# EAGLE design untitled (EAGLE 9.1.3)

## Sheet 1 of 2
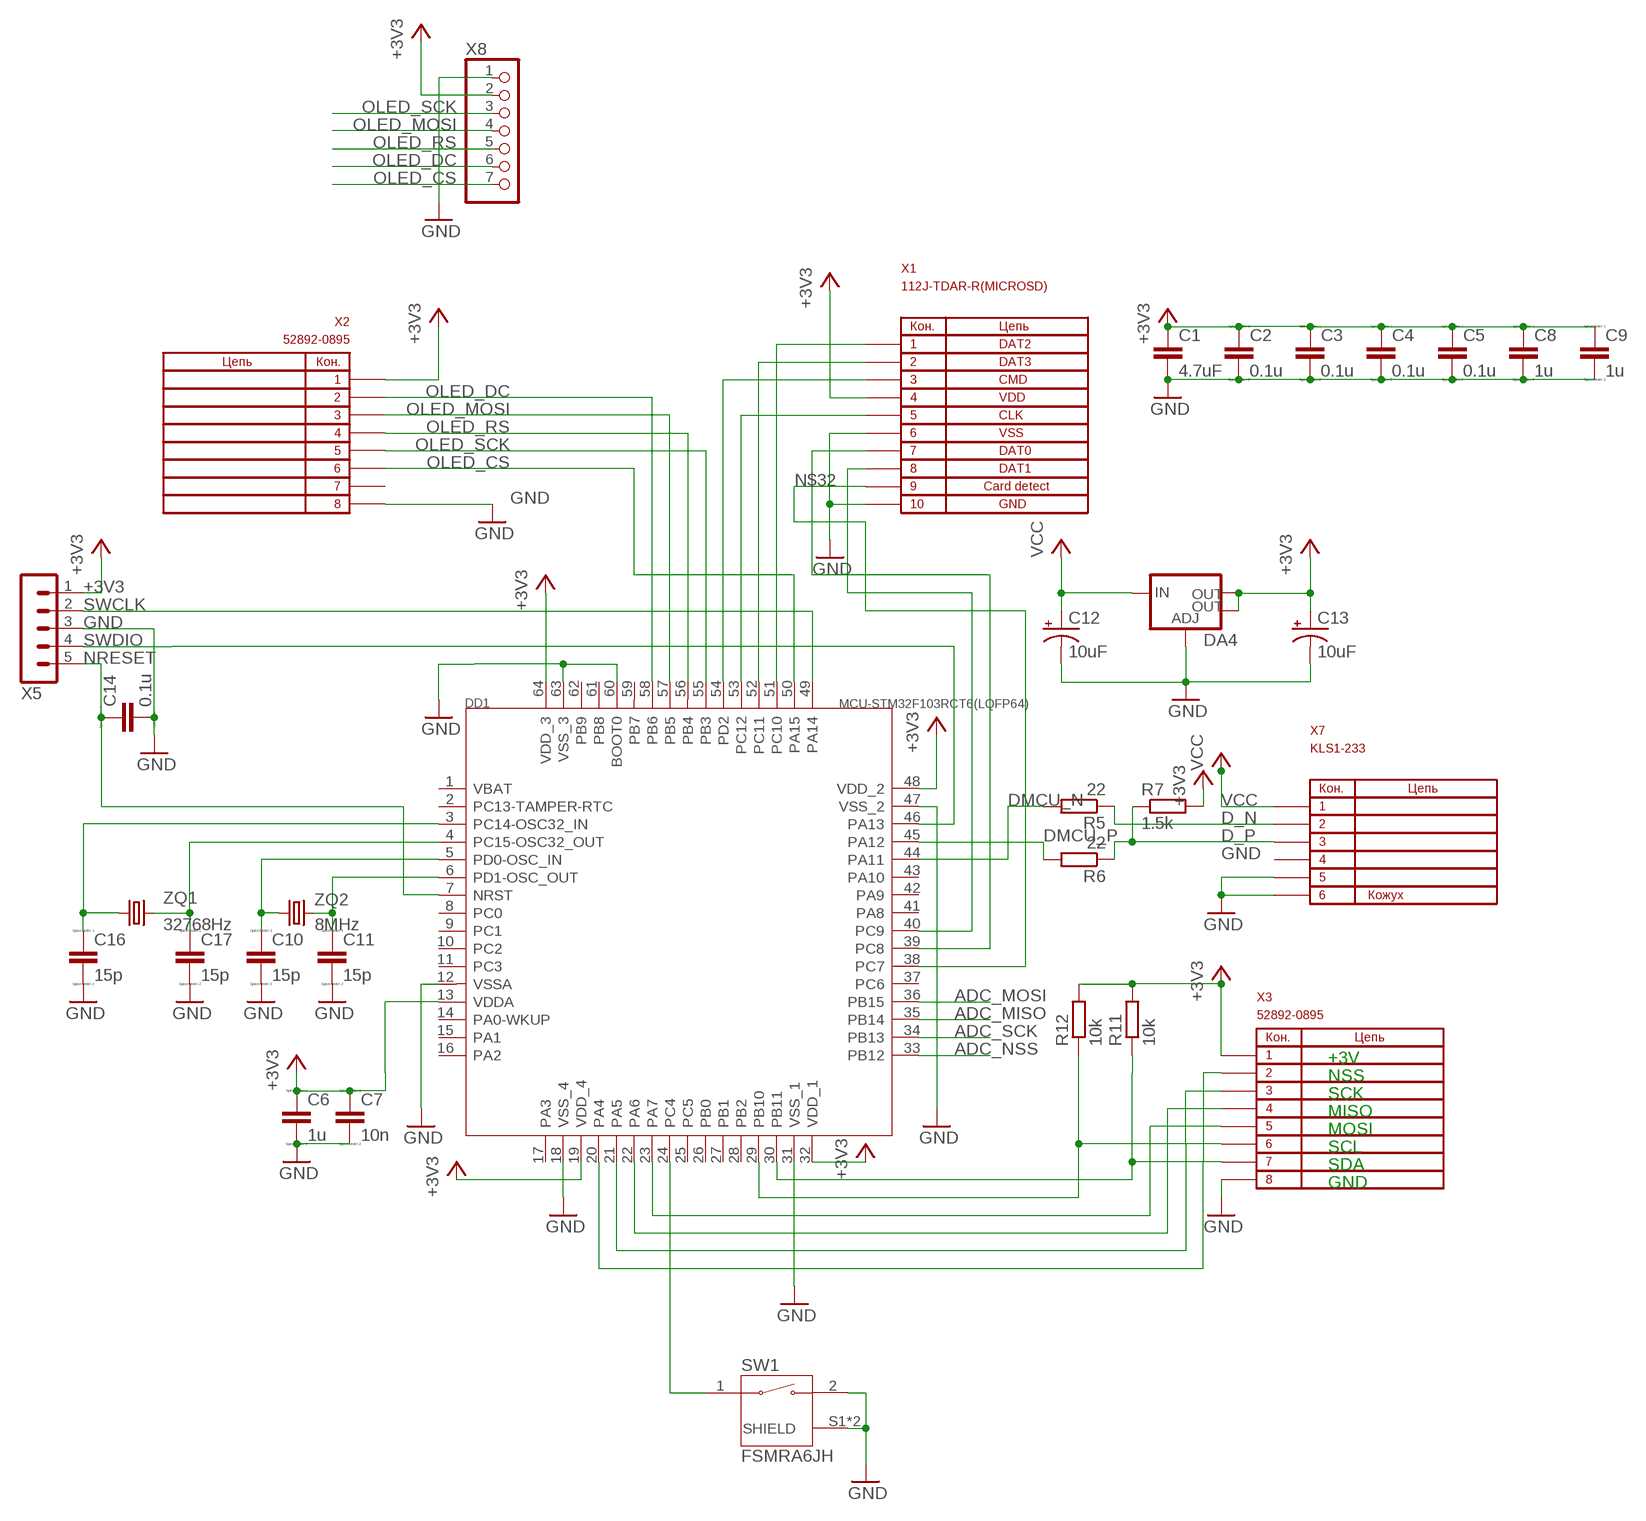
[diagram p0: schematic, sheet 1]

### Parts
C1  4.7uF  4.7UF0603  [0603]
C2  0.1u  CC0603  [C0603]
C3  0.1u  CC0603  [C0603]
C4  0.1u  CC0603  [C0603]
C5  0.1u  CC0603  [C0603]
C6  1u  CC0603  [C0603]
C7  10n  CC0603  [C0603]
C8  1u  CC0603  [C0603]
C9  1u  CC0603  [C0603]
C10  15p  CC0603  [C0603]
C11  15p  CC0603  [C0603]
C12  10uF  10UF-POLAR-EIA3216-16V-10%(TANT)  [EIA3216]
C13  10uF  10UF-POLAR-EIA3216-16V-10%(TANT)  [EIA3216]
C14  0.1u  CC0603  [C0603]
C16  15p  CC0603  [C0603]
C17  15p  CC0603  [C0603]
DA4  V_REG_LM1117SOT223  [SOT223]
DD1  MCU-STM32F103RCT6(LQFP64)  [LQFP64-0.5-10X10MM]
R5  22  R-EU_R0603  [R0603]
R6  22  R-EU_R0603  [R0603]
R7  1.5k  R-EU_R0603  [R0603]
R11  10k  R-EU_R0603  [R0603]
R12  10k  R-EU_R0603  [R0603]
SW1  FSMRA6JH  [TE_FSMRA6JH]
X1  112J-TDAR-R(MICROSD)  [112J-TDAR-R]
X2  52892-0895  [MOLEX_52892-0895]
X3  52892-0895  [MOLEX_52892-0895]
X5  MA05-1  [MA05-1]
X7  KLS1-233  [KLS1-233]
X8  PINHD-1X7  [1X07]
ZQ1  32768Hz  KX-327-NHT  [3.2X1.5]
ZQ2  8MHz  CRYSTALHC49UP  [HC49UP]

### Nets
+3V3: C1.1 C2.1 C3.1 C4.1 C5.1 C6.1 C7.1 C8.1 C9.1 C13.+ DA4.2(OUT) DA4.4(OUT) DD1.13(VDDA) DD1.19(VDD_4) DD1.32(VDD_1) DD1.48(VDD_2) DD1.64(VDD_3) R7.2 R11.2 R12.2 X1.P$4 X2.1 X3.1 X5.1 X8.2 ; also sheet 2
ADC_MISO: DD1.35(PB14) ; also sheet 2
ADC_MOSI: DD1.36(PB15) ; also sheet 2
ADC_NSS: DD1.33(PB12) ; also sheet 2
ADC_SCK: DD1.34(PB13) ; also sheet 2
D_N [diff pair]: R5.1 X7.2
D_P [diff pair]: R6.1 R7.1 X7.3
DMCU_N [diff pair]: DD1.44(PA11) R5.2
DMCU_P [diff pair]: DD1.45(PA12) R6.2
GND: C1.2 C2.2 C3.2 C4.2 C5.2 C6.2 C7.2 C8.2 C9.2 C10.2 C11.2 C12.- C13.- C14.2 C16.2 C17.2 DA4.1(ADJ) DD1.12(VSSA) DD1.18(VSS_4) DD1.31(VSS_1) DD1.47(VSS_2) DD1.60(BOOT0) DD1.63(VSS_3) SW1.2 SW1.S1(SHIELD) SW1.S2(SHIELD) X1.P$6 X1.P$10 X1.P$11 X1.P$12 X1.P$13 X2.8 X3.8 X5.3 X7.5 X7.SH4 X7.SH5 X7.SH6 X7.SH7 X8.1 ; also sheet 2
N$1: C10.1 DD1.5(PD0-OSC_IN) ZQ2.1
N$2: C11.1 DD1.6(PD1-OSC_OUT) ZQ2.2
N$7: C17.1 DD1.4(PC15-OSC32_OUT) ZQ1.2
N$8: C16.1 DD1.3(PC14-OSC32_IN) ZQ1.1
N$13: DD1.54(PD2) X1.P$3
N$14: DD1.53(PC12) X1.P$5
N$15: DD1.52(PC11) X1.P$2
N$16: DD1.51(PC10) X1.P$1
N$17: DD1.24(PC4) SW1.1
N$18: DD1.40(PC9) X1.P$8
N$19: DD1.39(PC8) X1.P$7
N$24: DD1.30(PB11) R11.1 X3.7
N$27: DD1.29(PB10) R12.1 X3.6
N$28: DD1.23(PA7) X3.5
N$29: DD1.22(PA6) X3.4
N$30: DD1.21(PA5) X3.3
N$31: DD1.20(PA4) X3.2
N$32: DD1.38(PC7) X1.P$9
NRESET: C14.1 DD1.7(NRST) X5.5
OLED_CS: DD1.50(PA15) X2.6 X8.7
OLED_DC: DD1.58(PB6) X2.2 X8.6
OLED_MOSI: DD1.57(PB5) X2.3 X8.4
OLED_RS: DD1.56(PB4) X2.4 X8.5
OLED_SCK: DD1.55(PB3) X2.5 X8.3
SWCLK: DD1.49(PA14) X5.2
SWDIO: DD1.46(PA13) X5.4
VCC: C12.+ DA4.3(IN) X7.1
Unconnected: DD1.1(VBAT) DD1.2(PC13-TAMPER-RTC) DD1.8(PC0) DD1.9(PC1) DD1.10(PC2) DD1.11(PC3) DD1.14(PA0-WKUP) DD1.15(PA1) DD1.16(PA2) DD1.17(PA3) DD1.25(PC5) DD1.26(PB0) DD1.27(PB1) DD1.28(PB2) DD1.37(PC6) DD1.41(PA8) DD1.42(PA9) DD1.43(PA10) DD1.59(PB7) DD1.61(PB8) DD1.62(PB9) X2.7 X7.4

### Notes on the sheet
- +3V
- NSS
- SCK
- MISO
- MOSI
- SCL
- SDA
- GND

## Sheet 2 of 2
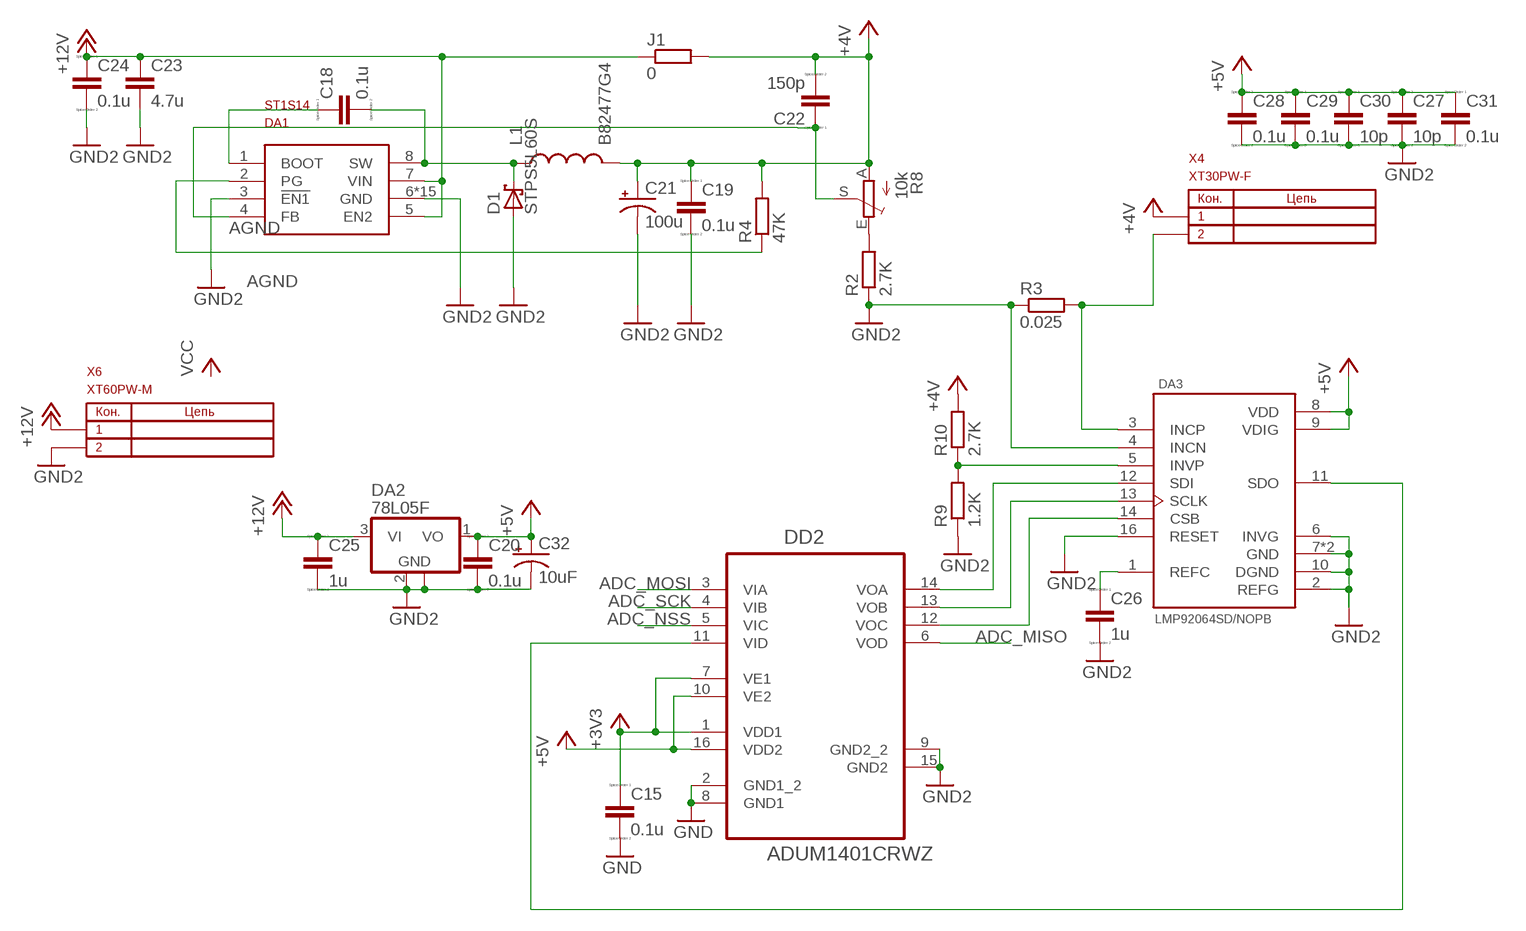
[diagram p1: schematic, sheet 2]

### Parts
C15  0.1u  CC0603  [C0603]
C18  0.1u  CC0603  [C0603]
C19  0.1u  CC0603  [C0603]
C20  0.1u  CC0603  [C0603]
C21  100u  CPOL-US150CLZ-1014  [150CLZ-1014]
C22  150p  CC0603  [C0603]
C23  4.7u  C-EUC2220K  [C2220K]
C24  0.1u  CC0603  [C0603]
C25  1u  CC1206  [C1206]
C26  1u  CC0603  [C0603]
C27  10p  CC0603  [C0603]
C28  0.1u  CC0603  [C0603]
C29  0.1u  CC0603  [C0603]
C30  10p  CC0603  [C0603]
C31  0.1u  CC0603  [C0603]
C32  10uF  10UF-POLAR-EIA3216-16V-10%(TANT)  [EIA3216]
D1  STPS5L60S  [SMC]
DA1  ST1S14  [HSOP8]
DA2  78L05F  [SOT89]
DA3  LMP92064SD/NOPB  [SON50P400X500X80-17N]
DD2  ADUM1401CRWZ  [SO-16W]
J1  0  R-EU_R2010  [R2010]
L1  B82477G4  [B82477G4]
R2  2.7K  R-EU_R0603  [R0603]
R3  0.025  R-EU_R2010  [R2010]
R4  47K  R-EU_R0603  [R0603]
R8  10k  TRIM_EU-CA6V  [CA6V]
R9  1.2K  R-EU_R0603  [R0603]
R10  2.7K  R-EU_R0603  [R0603]
X4  XT30PW-F  [XT30PW-F]
X6  XT60PW-M  [XT60PW-M]

### Nets
+3V3: C15.1 DD2.1(VDD1) DD2.7(VE1) ; also sheet 1
+4V: C19.1 C21.+ C22.2 J1.2 L1.P$2 R4.2 R8.A R10.2 X4.P$2
+5V: C20.1 C27.1 C28.1 C29.1 C30.1 C31.1 C32.+ DA2.1(VO) DA3.8(VDD) DA3.9(VDIG) DD2.10(VE2) DD2.16(VDD2)
+12V: C23.1 C24.1 C25.1 DA1.5(EN2) DA1.7(VIN) DA2.3(VI) J1.1 X6.P$2
ADC_MISO: DD2.6(VOD) ; also sheet 1
ADC_MOSI: DD2.3(VIA) ; also sheet 1
ADC_NSS: DD2.5(VIC) ; also sheet 1
ADC_SCK: DD2.4(VIB) ; also sheet 1
AGND: C19.2 C20.2 C21.- C23.2 C24.2 C25.2 C26.2 C27.2 C28.2 C29.2 C30.2 C31.2 C32.- D1.A DA1.3(!EN1) DA1.6(GND) DA1.P$9(GND) DA1.P$10(GND) DA1.P$11(GND) DA1.P$12(GND) DA1.P$13(GND) DA1.P$14(GND) DA1.P$15(GND) DA1.P$16(GND) DA1.P$17(GND) DA1.P$18(GND) DA1.P$19(GND) DA1.P$20(GND) DA1.P$21(GND) DA1.P$22(GND) DA2.2(GND) DA2.2@1(GND) DA3.2(REFG) DA3.4(INCN) DA3.6(INVG) DA3.7(GND) DA3.10(DGND) DA3.16(RESET) DA3.17(GND) DD2.9(GND2_2) DD2.15(GND2) R2.1 R3.1 R9.1 X6.P$1 ; supply symbol labelled GND2
GND: C15.2 DD2.2(GND1_2) DD2.8(GND1) ; also sheet 1
N$3: C26.1 DA3.1(REFC)
N$4: C18.1 DA1.1(BOOT)
N$5: DA3.13(SCLK) DD2.13(VOB)
N$6: DA3.14(CSB) DD2.12(VOC)
N$9: C18.2 D1.C DA1.8(SW) L1.P$1
N$10: C22.1 DA1.4(FB) R8.S
N$11: DA3.12(SDI) DD2.14(VOA)
N$12: DA1.2(PG) R4.1
N$22: R2.2 R8.E
N$23: DA3.3(INCP) R3.2 X4.P$1
N$25: DA3.5(INVP) R9.2 R10.1
N$26: DA3.11(SDO) DD2.11(VID)

## Library data of the parts
C1 = SparkFun-Capacitors:4.7UF: 4.7µF ceramic capacitors A capacitor is a passive two-terminal electrical component used to store electrical energy temporarily in an electric field.; PROD_ID: CAP-08280
C2-C11 C14-C20 C22 C24-C31 = eagle-ltspice:C: CAPACITOR, European symbol; SPICEMODEL: NONE; SPICEPREFIX: C
C12 C13 C32 = SparkFun-Capacitors:10UF-POLAR: 10.0µF polarized capacitors A capacitor is a passive two-terminal electrical component used to store electrical energy temporarily in an electric field.; PROD_ID: CAP-00811
C21 = rcl:CPOL-US: POLARIZED CAPACITOR, American symbol; SPICEPREFIX: C
C23 = rcl:C-EU: CAPACITOR, European symbol; SPICEPREFIX: C
D1 = untitled:STPS5L60S
DA1 = untitled:ST1S14
DA2 = linear:78L*: POSITOIV-VOLTAGE REGULATORS Output up to 100 mA Source: Datasheet <http://focus.ti.com/lit/ds/symlink/ua78l05.pdf>
DA3 = LMP92064SD_NOPB:LMP92064SD/NOPB: 125kSps Simultaneous Sampling, Low-Side, SPI Interface Current/Voltage Monitor 16-WSON -40 to 105; AVAILABILITY: Unavailable; DESCRIPTION: 125kSps Simultaneous Sampling, Low-Side, SPI Interface Current/Voltage Monitor 16-WSON -40 to 105; MF: Texas Instruments; MP: LMP92064SD/NOPB; PACKAGE: WSON-16 Texas Instruments; PRICE: None
DA4 = SparkFun-IC-Power:V_REG_LM1117: Voltage Regulator LM1117 Standard adjustable voltage regulator but in SMD form. Spark Fun Electronics SKU : COM-00595; PROD_ID: VREG-08170
DD1 = MCU-STM32F103RCT6_LQFP64_:MCU-STM32F103RCT6(LQFP64): 310010073; AVAILABILITY: Unavailable; DESCRIPTION: Mainstream Performance line, ARM Cortex-M3 MCU with 256 Kbytes Flash, 72 MHz CPU, motor control, USB and CAN; MF: STMicroelectronics; MP: STM32F103RCT6; PACKAGE: LQFP-64 STMicroelectronics; PRICE: None
DD2 = ADUM1401WTRWZ:ADUM1401CRWZ: IC, DIGITAL ISOLATOR; AVAILABILITY: Unavailable; DESCRIPTION: Ic Isolator Dig 4ch 125c 16soic - Adum1401wtrwz; MF: Analog Devices; MP: ADUM1401CRWZ; PACKAGE: SOIC-16 Analog Devices; PRICE: None
J1 R3 = rcl:R-EU_: RESISTOR, European symbol; SPICEPREFIX: R
L1 = untitled:B82477G4
R2 R4-R7 R9-R12 = resistor:R-EU_: RESISTOR, European symbol
R8 = pot:TRIM_EU-: POTENTIOMETER
SW1 = FSMRA6JH:FSMRA6JH: Switch, Tactile, Spno, r/a; AVAILABILITY: Unavailable; DESCRIPTION: Switch, Tactile, Spno, r/a; MF: TE Connectivity; MP: FSMRA6JH; PACKAGE: None; PRICE: None; TE_PURCHASE_URL: https://www.te.com/usa-en/product-FSMRA6JH.html?te_bu=Cor&te_type=disp&te_campaign=seda_glo_cor-seda-global-disp-prtnr-fy19-seda-model-bom-cta_sma-317_1&elqCampaignId=32493
X1 = untitled:112J-TDAR-R(MICROSD)
X2 X3 = 52892-0895:52892-0895: CONNECTOR, FPC, ZIF, 0.50MM, 08 WAY; AVAILABILITY: Unavailable; DESCRIPTION: Conn FFC/FPC Connector SKT 8 POS 0.5mm Solder RA SMD Embossed T/R; MF: Molex; MP: 52892-0895; PACKAGE: None; PRICE: None
X4 = untitled:XT30PW-F
X5 = con-lstb:MA05-1: PIN HEADER; OC_FARNELL: unknown; OC_NEWARK: unknown
X6 = untitled:XT60PW-M
X7 = untitled:KLS1-233
X8 = pinhead:PINHD-1X7: PIN HEADER
ZQ1 = crystal-geyer_V1_0:KX-327: Tuning Fork Crystals (kHz) SMD: KX327 - Serie Model Size l/w/h [mm] Frequency Range Frequency Stability Temp. Range [°C] Load Capacitance AECQ 200 availabel Datasheet KX-327VT KX-327FT KX-327RT KX-327NHT KX-327NHF KX-327L KX-327S 1.25/1.05/0.5 1.6/1.0/0.5 2.0/1.2/0.6 3.2/1.5/0.8 3.2/1.5/0.8 7.0/1.5/1.4 8.2/3.8/2.5 32,768 kHz 32,768 kHz 32,768 kHz 32,768 kHz 32,768 kHz 32,768 kHz 32,768 kHz ±10 … ±20ppm ±10 … ±20ppm ±10 … ±20ppm ±10 … ±20ppm ±10 … ±20ppm ±10 … ±20ppm ±5 … ±20ppm (*) -40°C …+85°C (*) -40°C …+85°C (*) -40°C …+85°C (*) -40°C …+85°C (*) -40°C …+125°C (*) -40°C …+85°C (*) -40°C …+85°C 7/9/12,5 7/9/12,5 7/9/12,6 7/9/12,5 9/12,5 7/9/12,5 6/12,5 - - - - yes - - KX-327VT.pdf <http://www.geyer-electronic.de/uploads/tx_userartikelfrequenz/GEYER-KX-327VT.pdf> KX-327FT.pdf <http://www.geyer-electronic.de/uploads/tx_userartikelfrequenz/GEYER-KX-327FT.pdf> KX-327RT.pdf <http://www.geyer-electronic.de/uploads/tx_userartikelfrequenz/GEYER-KX-327RT.pdf> KX-327NHT.pdf <http://www.geyer-electronic.de/uploads/tx_userartikelfrequenz/GEYER-KX-327NHT.pdf> KX-327NHF.pdf <http://www.geyer-electronic.de/uploads/tx_userartikelfrequenz/GEYER-KX-327NHF.pdf> KX-327L.pdf <http://www.geyer-electronic.de/uploads/tx_userartikelfrequenz/GEYER-KX-327L.pdf> KX-327S.pdf <http://www.geyer-electronic.de/uploads/tx_userartikelfrequenz/GEYER-KX-327S.pdf> <http://www.geyer-electronic.de/fileadmin/template/img/logo-geyer-electronic.png> Details see: http://www.geyer-electronic.de/Frequenz-Produkte.9.0.html Created 2016-06-07, Hans Locher 2016 (C) Geyer Quartz Technology KX327VT,KX327FT,KX327RT,KX327NHT,KX327NHF,KX327S,KX327L;125105;1610;2012;3215;7015;8238;1,25x1,05,1.25x1.05;1,6x1,0,1.6x1.0;2,0x1,2,2.0x1.2;3,2x1,5,3.2x1.5;8,2x3,8,8.2x3.8,7.0x1.5,7,0x1,532.768kHz
ZQ2 = crystal:CRYSTAL: CRYSTAL; OC_FARNELL: unknown; OC_NEWARK: unknown

## Net classes
1 diff pair: width 0.7 mm, clearance 0.2 mm

## Board
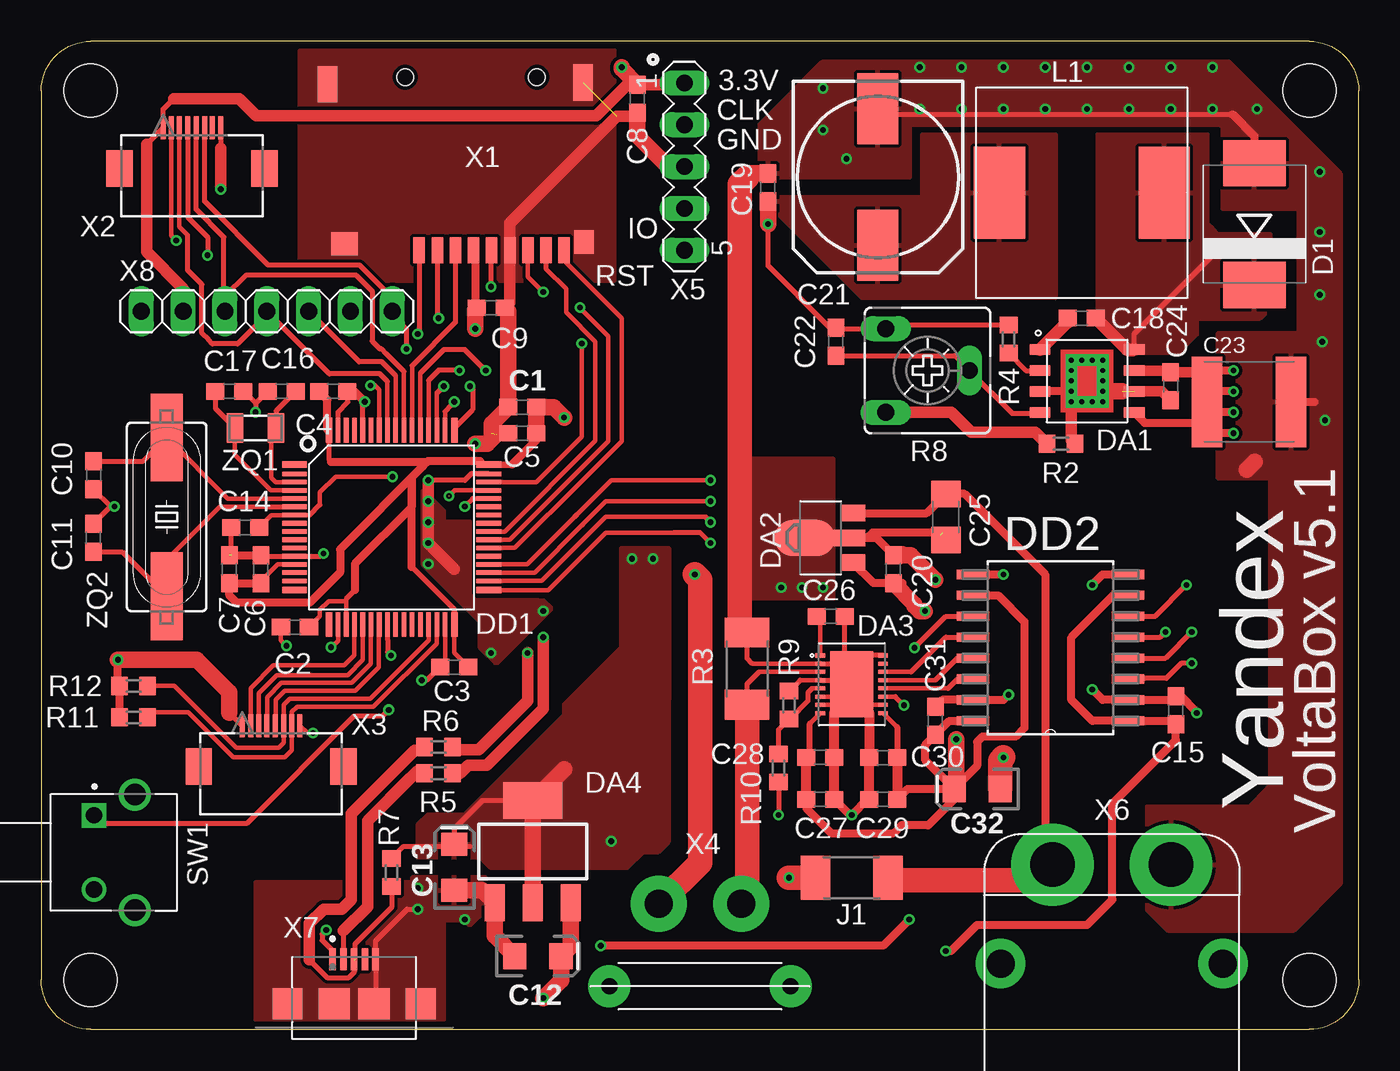
[diagram p2: board, top side]
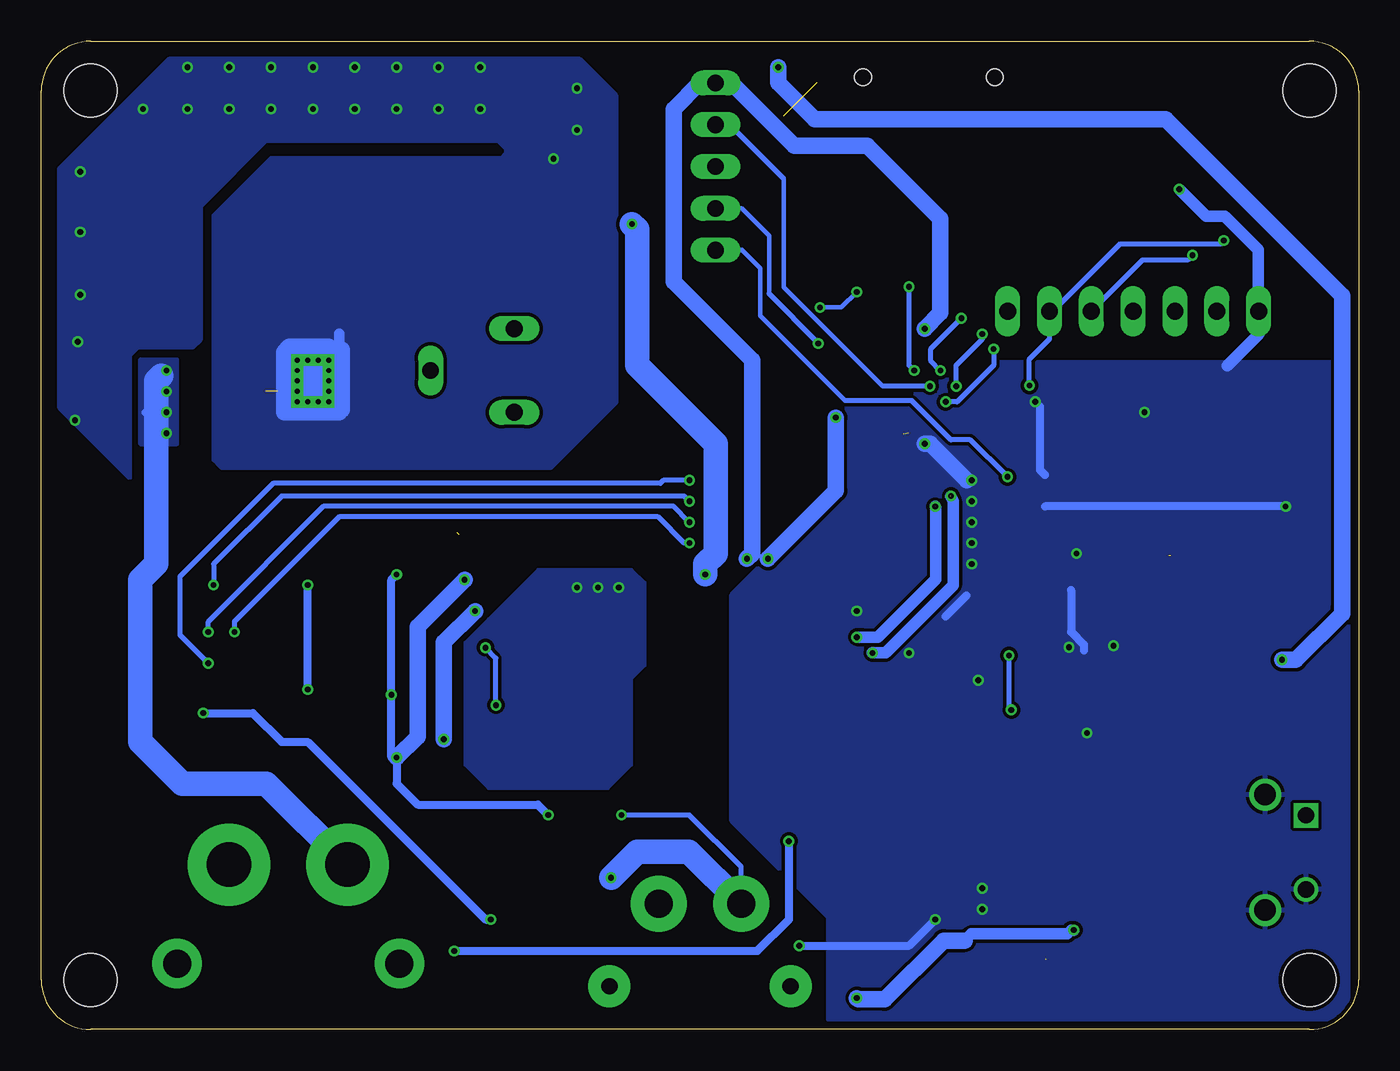
[diagram p3: board, bottom side, seen from below]

Size 80 x 60 mm. Coordinates in mm from the lower left corner, seen from the top.
Outline: 3,0 77,0 arc90 80,3 80,57 arc90 77,60 3,60 arc90 0,57 0,3 arc90 3,0
Copper layers (1*16): Top 0.035mm / dielectric 1.5mm / Bottom 0.035mm
Design rules "rezonit_2x0.35": minimum track width 8mil, minimum drill 0.3mm, track to track 8mil, track to pad 8mil, pad to pad 8mil, via to via 8mil, smd to smd 8mil, copper to edge 10mil, drill to drill 10mil, minimum pad ring 8mil, minimum via ring 6mil, stop-mask expansion 6mil, vias tented up to drill 0mil, thermal gap 8mil
Holes 3.2 mm at 3,3 77,3 3,57 77,57

### Footprints (pad centres in the part's own frame; a part is rotated, then mirrored left to right if it is on the bottom)
0603 = smd 1.1 x 1: 1 -0.85,0; 2 0.85,0
C0603 = smd 1.1 x 1: 1 -0.85,0; 2 0.85,0
EIA3216 = smd 1.4 x 1.6: + 1.4,0; - -1.4,0
150CLZ-1014 = smd 4.3 x 2.5: + 4.15,0; - -4.15,0
C2220K = smd 1.85 x 5.5: 1 -2.55,0; 2 2.55,0
C1206 = smd 1.6 x 1.8: 1 -1.4,0; 2 1.4,0
SMC = smd 2.8 x 3.8: A 3.7,0; C -3.7,0
HSOP8 = smd 1.27 x 0.635: 1 0,0; 2 0,-1.27; 3 0,-2.54; 4 0,-3.81; 5 5.715,-3.81; 6 5.715,-2.54; 7 5.715,-1.27; 8 5.715,0 | drill 0.3 pad 0.61 square: P$9 1.905,-0.635; P$10 1.905,-1.27; P$11 1.905,-1.905; P$12 1.905,-2.54; P$13 1.905,-3.175; P$14 2.54,-3.175; P$15 3.175,-3.175; P$16 3.81,-3.175; P$17 3.81,-2.54; P$18 3.81,-1.905; P$19 3.81,-1.27; P$20 3.81,-0.635; P$21 3.175,-0.635; P$22 2.54,-0.635
SOT89 = smd 1 x 1.5: 1 -1.499,-1.981; 3 1.499,-1.981 | smd 1 x 2: 2 0,-1.727 | smd 2.2 x 3.7: 2@1 0,0.94
SON50P400X500X80-17N = smd 0.6 x 0.25: 1 -1.9,1.75; 2 -1.9,1.25; 3 -1.9,0.75; 4 -1.9,0.25; 5 -1.9,-0.25; 6 -1.9,-0.75; 7 -1.9,-1.25; 8 -1.9,-1.75; 9 1.9,-1.75; 10 1.9,-1.25; 11 1.9,-0.75; 12 1.9,-0.25; 13 1.9,0.25; 14 1.9,0.75; 15 1.9,1.25; 16 1.9,1.75 | smd 2.6 x 4: 17 0,0
SOT223 = smd 1.219 x 2.235: 1 -2.311,-3.099; 2 0,-3.099; 3 2.311,-3.099 | smd 3.6 x 2.2: 4 0,3.099
LQFP64-0.5-10X10MM = smd 1.5 x 0.4: 1 -5.9,3.81; 16 -5.9,-3.81; 33 5.9,-3.81; 48 5.9,3.81 | smd 1.5 x 0.28: 2 -5.9,3.25; 3 -5.9,2.75; 4 -5.9,2.25; 5 -5.9,1.75; 6 -5.9,1.25; 7 -5.9,0.75; 8 -5.9,0.25; 9 -5.9,-0.25; 10 -5.9,-0.75; 11 -5.9,-1.25; 12 -5.9,-1.75; 13 -5.9,-2.25; 14 -5.9,-2.75; 15 -5.9,-3.25; 34 5.9,-3.25; 35 5.9,-2.75; 36 5.9,-2.25; 37 5.9,-1.75; 38 5.9,-1.25; 39 5.9,-0.75; 40 5.9,-0.25; 41 5.9,0.25; 42 5.9,0.75; 43 5.9,1.25; 44 5.9,1.75; 45 5.9,2.25; 46 5.9,2.75; 47 5.9,3.25 | smd 0.4 x 1.5: 17 -3.81,-5.9; 32 3.81,-5.9; 49 3.81,5.9; 64 -3.81,5.9 | smd 0.28 x 1.5: 18 -3.25,-5.9; 19 -2.75,-5.9; 20 -2.25,-5.9; 21 -1.75,-5.9; 22 -1.25,-5.9; 23 -0.75,-5.9; 24 -0.25,-5.9; 25 0.25,-5.9; 26 0.75,-5.9; 27 1.25,-5.9; 28 1.75,-5.9; 29 2.25,-5.9; 30 2.75,-5.9; 31 3.25,-5.9; 50 3.25,5.9; 51 2.75,5.9; 52 2.25,5.9; 53 1.75,5.9; 54 1.25,5.9; 55 0.75,5.9; 56 0.25,5.9; 57 -0.25,5.9; 58 -0.75,5.9; 59 -1.25,5.9; 60 -1.75,5.9; 61 -2.25,5.9; 62 -2.75,5.9; 63 -3.25,5.9
SO-16W = smd 1.981 x 0.559: 1 -4.699,4.445; 2 -4.699,3.175; 3 -4.699,1.905; 4 -4.699,0.635; 5 -4.699,-0.635; 6 -4.699,-1.905; 7 -4.699,-3.175; 8 -4.699,-4.445; 9 4.699,-4.445; 10 4.699,-3.175; 11 4.699,-1.905; 12 4.699,-0.635; 13 4.699,0.635; 14 4.699,1.905; 15 4.699,3.175; 16 4.699,4.445
R2010 = smd 1.8 x 2.7: 1 -2.2,0; 2 2.2,0
B82477G4 = smd 5.6 x 3.1: P$1 0,-5; P$2 0,5
R0603 = smd 1 x 1.1: 1 -0.85,0; 2 0.85,0
CA6V = drill 1.016 long: A -2.54,-2.54; E 2.54,-2.54; S 0,2.54
TE_FSMRA6JH = drill 0.99 square: 1 0,0 | drill 0.99: 2 4.5,0 | drill 1.3: S1 -1.255,2.49; S2 5.755,2.49
112J-TDAR-R = smd 0.7 x 1.6: P$1 8.8,0; P$2 7.7,0; P$3 6.6,0; P$4 5.5,0; P$5 4.4,0; P$6 3.3,0; P$7 2.2,0; P$8 1.1,0; P$9 0,0 | smd 1.6 x 1.4: P$10 13.34,-0.4 | smd 1.2 x 2.2: P$11 14.37,-10.08; P$12 -1.15,-10.18 | smd 1.2 x 1.4: P$13 -1.2,-0.5 | hole 1: 1.65,-10.5; 9.65,-10.5
MOLEX_52892-0895 = smd 0.305 x 1.397: 1 1.753,2.896; 2 1.245,2.896; 3 0.762,2.896; 4 0.254,2.896; 5 -0.254,2.896; 6 -0.762,2.896; 7 -1.245,2.896; 8 -1.753,2.896 | smd 1.6 x 2.21: 9 -4.394,5.359; 10 4.394,5.359
XT30PW-F = drill 1.7 pad 3.4: P$1 -2.5,0; P$2 2.5,0 | drill 1 pad 2.54: P$3 5.5,5; P$4 -5.5,5
MA05-1 = drill 1.016 long: 1 -5.08,0; 2 -2.54,0; 3 0,0; 4 2.54,0; 5 5.08,0
XT60PW-M = drill 2.7 pad 5: P$1 -3.6,0; P$2 3.6,0 | drill 1.7 pad 3: P$3 6.75,6; P$4 -6.75,6
KLS1-233 = smd 0.4 x 1.35: 1 -1.3,1.08; 2 -0.65,1.08; 3 0,1.08; 4 0.65,1.08; 5 1.3,1.08 | smd 1.8 x 1.9: SH4 -4.05,-1.62; SH7 4.05,-1.62 | smd 1.9 x 1.9: SH5 -1.2,-1.62; SH6 1.2,-1.62
1X07 = drill 1.016 long: 1 -7.62,0; 2 -5.08,0; 3 -2.54,0; 4 0,0; 5 2.54,0; 6 5.08,0; 7 7.62,0
3.2X1.5 = smd 1 x 1.8: 1 -1.25,0; 2 1.25,0
HC49UP = smd 5.334 x 1.93: 1 -4.826,0; 2 4.826,0

### Placement (x,y rotation side)
C1  29.21,37.78 180 top
C2  15.41,24.43 180 top
C3  25.08,22.01 180 top
C4  17.73,38.73 0 top
C5  29.21,36.2 180 top
C6  13.34,27.94 90 top
C7  11.43,27.94 90 top
C8  36.2,56.52 270 top
C9  27.3,43.81 0 top
C10  3.17,33.66 270 top
C11  3.17,29.84 90 top
C12  30.16,4.45 0 top
C13  25.08,9.84 90 top
C14  12.38,30.48 180 top
C15  68.9,19.37 90 top
C16  14.61,38.74 180 top
C17  11.43,38.74 0 top
C18  63.18,43.18 0 top
C19  44.13,51.12 90 top
C20  51.75,27.94 90 top
C21  50.8,51.75 270 top
C22  48.26,41.75 90 top
C23  73.34,38.1 0 top
C24  68.58,39.05 270 top
C25  54.93,31.11 270 top
C26  47.94,25.08 0 top
C27  47.31,13.97 0 top
C28  47.31,16.51 0 top
C29  51.12,13.97 180 top
C30  51.12,16.51 180 top
C31  54.29,18.73 90 top
C32  56.83,14.61 180 top
D1  73.66,48.9 90 top
DA1  60.64,41.27 0 top
DA2  47.31,29.84 90 top
DA3  49.21,20.95 0 top
DA4  29.84,10.79 0 top
DD1  21.27,30.48 0 top
DD2  61.28,23.18 180 top
J1  49.21,9.21 180 top
L1  63.18,50.8 90 top
R2  61.91,35.56 180 top
R3  42.86,21.91 270 top
R4  58.74,41.91 90 top
R5  24.13,15.56 0 top
R6  24.13,17.14 0 top
R7  21.27,9.53 90 top
R8  53.82,40.01 270 top
R9  45.4,19.68 270 top
R10  44.77,15.88 270 top
R11  5.62,18.95 180 top
R12  5.62,20.85 180 top
SW1  3.2,13 270 top
X1  31.75,47.31 180 top
X2  9.15,57.63 180 top
X3  13.96,21.33 180 top
X4  40,7.62 180 top
X5  39.05,52.39 270 top
X6  65,10 180 top
X7  19,3.17 0 top
X8  13.7,43.6 0 top
ZQ1  13.02,36.52 180 top
ZQ2  7.62,31.11 270 top

### Tracks (layer width: path | path; a pad name or v marks a point on that pad's centre or on a via)
+3V3  (via drill 0.35)
  Top 0.275: DD1.13 14.36,28.23 13.34,27.2 | C3.1 25.08,22.86 DD1.32 | DD1.19 18.52,26 | 18.52,26 18.52,26.14 | C2.1 16.92,25.09 16.92,25.47 17.45,26 18.52,26
  Top 0.3: DA4.4 26.78,13.89 25.08,12.2 C13.+ | C5.1 30.03,36.2 | 23.18,34.18 22.86,33.87 | 25.08,25.41 DD1.32 25.08,24.77 25.08,25.5 22.5,28.09 | DD1.48 27.49,34.29 | R7.2 22.01,11.11 26.04,11.11 | DD1.64 17.46,34.6 17.59,34.47 | 23.46,34.47 22.86,33.87 | 8.04,56.52 7.4,55.87 X2.1 6.4,53.73 | 18.52,26.14 19.05,26.67 | 13.34,27.2 C6.1 | 22.86,33.87 22.5,33.5 | X3.1 11.41,19.24
  Top 0.4: 28.57,34.29 DD1.48 26.86,34.29 26.64,34.5 | DD1.64 17.38,36.38
  Top 0.5: 22.5,28.09 22.5,33.5 22.5,31.7 19.05,28.26 19.05,26.67 | 26.64,34.5 23.5,34.5 23.18,34.18 18.14,29.15 18.14,27.75 16.31,25.92 11.87,25.92 11.43,26.35 C7.1 C6.1 | 28.57,34.29 30.06,35.77 C5.1 | DD2.7 65.11,26.35 62.55,23.8 62.55,20 63.82,18.73 DD2.1 68.68,18.73 C15.1 68.9,17.57 65.04,13.7 65.04,7.89 63.5,6.35 56.83,6.35 55.24,4.76 v54.93,4.76 | C9.1 26.35,43.92 26.35,47.2 X1.P$4 | 17.59,34.47 23.46,34.47 | R11.2 R12.2 4.66,20.95 v4.66,22.44 | 17.38,36.38 17.38,38.23 C4.1
  Top 0.7: X5.1 38.95,57.37 C8.1 35.59,57.37 33.7,55.47 13.06,55.47 12.01,56.52 8.04,56.52 | 6.4,53.73 6.4,47.2 8.62,44.98 X8.2
  Top 1: C5.1 C1.1 31.11,37.78 v31.75,37.15 | C9.1 26.35,43.71 v26.35,42.55 | 31.75,15.8 DA4.4 | 29.84,13.26 DA4.2 | C8.1 35.24,58.32 v35.24,58.42 | v4.66,22.44 9.44,22.44 11.41,20.47 11.41,19.24
  Bottom 0.5: v54.93,4.76 36.51,4.76 34.61,6.67 v34.61,11.43
  Bottom 1: v35.88,28.57 31.75,32.7 v31.75,37.15 | v37.15,28.57 36.83,28.89 36.83,40.64 41.59,45.4 41.59,55.88 40.01,57.47 X5.1 38.1,57.47 34.29,53.66 29.84,53.66 25.4,49.21 25.4,46.35 25.4,43.5 v26.35,42.55 | v35.24,58.42 35.24,57.47 33.02,55.24 11.73,55.24 1.02,44.53 1.02,25.58 1.02,25.24 3.82,22.44 v4.66,22.44
  pour Top (no thermals): 34.61,20 34.92,20 36.2,20
  pour Top: 35.24,20 35.24,29.21 38.1,29.21 38.1,20.32 38.1,20
  pour Top (no thermals): 27.62,9.84 35.56,9.84 36.51,10.79 37.47,10.79 38.1,11.43 38.1,23.18 35.24,23.18 31.75,19.68 31.75,19.05 27.62,14.92
  pour Top: 27.62,14.92 25.72,13.02 23.5,13.02 22.86,12.38 22.86,10.48 26.67,10.48 27.3,9.84 27.62,9.84
+4V  (via drill 0.35)
  Top 0.3: R4.2 51.49,42.76 R8.A 48.32,42.55 C22.2 47.89,42.6 47.7,42.78 44.13,46.35 v44.13,48.9 | R10.2 v44.77,13.02
  Top 1: v44.13,48.9 C19.1
  Top 1.5: v39.69,27.62 40.01,27.3 40.01,10.12 X4.P$2 | J1.2 v45.4,9.21
  Bottom 0.3: v44.77,13.02 40.64,13.02 37.5,9.88 X4.P$2
  Bottom 1.5: v44.13,48.9 43.81,48.58 43.81,40.32 39.05,35.56 39.05,28.89 39.69,28.26 v39.69,27.62 | v45.4,9.21 43.81,10.79 40.67,10.79 X4.P$2
  pour Top: 61.59,44.45 61.59,54.29 53.5,54.29 53.5,50.48 44.45,50.48 44.13,50.48 43.81,50.48 49.85,44.45
+5V  (via drill 0.35)
  Top 0.275: DA3.9 51.97,18.35 | 46.67,18.57 DA3.8
  Top 0.35: 51.97,18.35 C30.1 | C28.1 46.67,16.73 46.67,18.57
  Top 0.5: C20.1 50.54,27.09 DA2.1 | DD2.16 55.14,18.73 C31.1 53.66,17.25 53.66,16.38 C32.+ | C20.1 51.97,27.09 | C27.1 46.46,13.42 47.95,11.92 51.75,11.92 52.22,12.38 53.84,12.38 55.43,13.97 C32.+ | C32.+ 52.6,14.61 C29.1 | C32.+ 56.83,16 56.83,17.46 57.15,17.78 59.16,17.78 59.69,18.31 59.69,24.77 58.1,26.35 DD2.10 | C20.1 52.28,27.09
  Top 0.6: C30.1 C29.1 | C27.1 C28.1
  Top 1: C20.1 53.02,25.82 53.02,25.72 53.34,25.4 v53.66,25.4 | v55.56,17.61 55.56,14.73 C32.+
  Bottom 1: v53.66,25.4 55.56,23.5 v55.56,17.61
+12V  (via drill 0.35)
  Top 0.5: 70.48,36.83 66.99,36.83 DA1.5 | v72.39,36.2 71.12,36.2 | v72.39,38.73 71.43,38.73 C23.1 | v72.39,40.01 72.38,39.99 70.8,39.99 70.15,39.99 | v72.39,37.47 70.8,37.47 70.48,37.78 | DA2.3 53.76,31.34 C25.1 56.07,32.52 60.96,27.62 60.96,10.44 X6.P$2
  Top 0.65: DA1.7 68.48,40.01 C24.1 70.72,39.9 70.8,39.99
  Top 1: 70.48,39.66 70.48,37.78 70.48,36.83
  Top 1.5: X6.P$2 60.45,9.05 51.57,9.05 J1.1
  Bottom 0.5: v72.39,37.47 73.66,37.47
  Bottom 1.5: 72.71,39.69 73.03,39.37 73.03,28.26 73.98,27.3 73.98,17.78 73.98,17.46 71.44,14.92 66.32,14.92 X6.P$2
  pour Bottom: 71.75,35.56 71.75,40.64 73.98,40.64 73.98,35.56
ADC_MISO  (via drill 0.35)
  Top 0.275: v40.64,32.07 34.29,32.07 32.86,30.64 29.95,27.73 DD1.35
  Top 0.3: DD2.6 67.63,25.08 v69.53,26.99 | 32.81,30.59 32.86,30.64
  Bottom 0.3: v69.53,26.99 69.53,28.26 65.41,32.38 40.96,32.38 v40.64,32.07
ADC_MOSI  (via drill 0.35)
  Top 0.275: v40.64,33.34 34.61,33.34 32.54,31.27 29.5,28.23 DD1.36
  Top 0.3: 32.38,31.11 32.54,31.27 | v69.85,22.23 69.22,22.23 68.31,21.32 66.97,21.32 66.93,21.27 DD2.3
  Bottom 0.3: v69.85,22.23 71.57,23.95 71.57,27.49 65.91,33.16 42.41,33.16 42.23,33.34 v40.64,33.34
ADC_NSS  (via drill 0.35)
  Top 0.275: 38.42,30.16 34.29,30.16 32.38,28.26 30.8,26.67 DD1.33 | v40.64,29.53 40.01,30.16
  Top 0.3: DD2.5 67.94,23.81 v68.26,24.13 | 40.01,30.16 38.42,30.16
  Bottom 0.3: v68.26,24.13 68.26,24.77 61.91,31.11 42.55,31.11 40.96,29.53 v40.64,29.53
ADC_SCK  (via drill 0.35)
  Top 0.275: DD1.34 30.4,27.23 34.28,31.11 40.32,31.11
  Top 0.3: DD2.4 68.26,22.54 v69.85,24.13 | v40.64,30.8 40.32,31.11
  Bottom 0.3: v69.85,24.13 69.85,24.77 62.87,31.75 41.59,31.75 v40.64,30.8
AGND  (via drill 0.35)  (2 unrouted)
  Top 0.275: DA3.10 50.1,19.7 DA3.7 | DA3.2 43.18,22.2 | DA3.6 48.46,20.2 | 46.07,21.2 DA3.4
  Top 0.3: DA3.2 47.92,22.2 | DA3.2 47.96,22.2 48.18,21.99 48.9,21.27 | 48.9,21.27 DA3.17 | DA3.16 50.33,22.7 48.9,21.27 | DA3.4 48.83,21.2 48.9,21.27 | 48.58,20.32 48.46,20.2 DA3.17 | R9.1 46.07,21.2 | DA1.P$13 62.55,37.47 | 48.58,24.87 C26.2 48.79,21.38 DA3.17 | 72.34,55.56 51.14,55.56 C21.- | 43.18,22.2 42.86,22.52 R3.1 | DA3.2 | DA3.17 49.21,20.59 50.1,19.7 | DA3.17 49.21,20.32 50.27,19.27
  Top 0.5: 51.54,29 50.7,29.84 50.3,29.84 50.16,29.84 | 51.54,29 C20.2 | C27.2 49.21,12.91 v49.21,13.02 50.16,13.97 C29.2 | 52.39,29.08 51.62,29.08 51.54,29 | C31.2 54.71,20 DD2.15 58.42,20 | 58.42,20 v58.74,20.32 58.42,20 | DA2.2 49.85,29.84 50.16,29.84 | 54.74,30.16 50.48,30.16 50.16,29.84 | C25.2 54.61,30.03 | DD2.9 v58.42,27.62 | DA1.P$12 DA1.3 | 72.34,55.56 73.66,54.24 D1.A | C23.2 77.32,38.1 | DA3.17 48.18,21.99
  Top 0.6: 50.27,19.27 C30.2 C29.2 | 48.16,19.27 C28.2 C27.2
  Top 0.65: DA1.6 68.05,38.73 C24.2
  Top 0.7: DA1.P$13 62.55,35.77 R2.1
  Top 1: DA1.P$17 65.64,38.73 | 73.18,33.97 73.67,34.46 | C20.2 52.81,28.79 v54.29,27.3 | C19.2 43.08,51.97 42.86,51.75
  Top 1.5: C32.- 58.23,16.32 v58.42,16.51 | 42.86,51.75 42.41,51.3 42.41,24.56 R3.1
  Bottom 0.3: DA1.P$9 62.71,40.64 | 62.71,40.64 DA1.P$22 DA1.P$21 DA1.P$20 DA1.P$19 DA1.P$18 DA1.P$17 DA1.P$16 DA1.P$15 DA1.P$14 DA1.P$13 DA1.P$12 DA1.P$11 DA1.P$10 62.55,40.48 62.71,40.64
  Bottom 0.5: v58.42,27.62 58.74,27.3 v58.74,20.32 58.74,16.51 v58.42,16.51 58.42,14.92 57.15,13.65 49.85,13.65 v49.21,13.02
  Bottom 0.65: 61.75,41.27 61.91,41.43 61.91,42.23
  Bottom 1: v54.29,27.3 57.15,24.45 57.15,17.78 v58.42,16.51 | DA1.P$9 62.55,41.43 64.93,41.43 65.25,41.12 65.25,37.47 61.91,37.47 61.75,37.62 61.75,41.27 61.91,41.27 DA1.P$9
  other vias: 53.34,58.42 53.34,55.88 55.88,58.42 55.88,55.88 58.42,58.42 58.42,55.88 60.96,55.88 60.96,58.42 63.5,58.42 63.5,55.88 66.04,58.42 66.04,55.88 68.58,55.88 68.58,58.42 71.12,58.42 71.12,55.88 77.63,48.42 77.63,44.61 77.79,41.75 77.63,52.07 77.95,36.99 47.47,26.83 46.2,26.83 44.93,26.83 73.82,55.88 47.47,57.15 47.47,54.61 48.9,52.86
  pour Top: 43.66,54.93 47.47,58.74 72.07,58.74 76.68,54.13 78.74,52.07 78.74,49.85 71.75,49.85 71.75,54.77 71.6,54.93 66.99,54.93 52.7,54.93 52.7,51.75 43.66,51.75
  pour Top: 71.44,42.23 71.44,33.5 74.61,33.5 78.9,37.78 78.9,51.91 78.74,52.07 76.36,54.45 71.75,54.45 71.75,50.01 71.75,49.85 76.36,49.85 76.36,42.23
  pour Top (no thermals): 42.7,26.19 48.1,26.19 48.1,34.61 41.91,34.61 41.91,26.19
  pour Bottom (no thermals): 52.39,58.9 72.23,58.9 78.9,52.23 78.9,51.91 78.9,37.78 74.61,33.5 74.61,40.96 74.14,41.43 70.8,41.43 70.33,41.91 70.33,42.07 70.33,50.01 70.17,50.16 66.36,53.98 53.98,53.98 52.39,53.98
  pour Top: 68.42,6.03 76.04,6.03 78.9,8.89 78.9,37.78 74.61,33.5 74.61,14.76 74.45,14.61 73.34,13.49 67.15,13.49 67.15,7.3
  pour Bottom: 43.34,27.15 43.34,22.07 44.13,21.27 44.13,16.03 45.56,14.61 52.86,14.61 54.29,16.03 54.29,23.5 52.86,24.92 49.85,27.94 44.13,27.94
  pour Bottom: 52.55,58.9 52.55,54.29 51.75,53.5 51.75,53.18 52.07,52.86 66.04,52.86 69.22,49.69 69.53,49.37 69.53,34.61 69.06,34.13 68.74,34.13 49.05,34.13 45.09,38.1 45.09,56.67 47.31,58.9
D_N
  Top 0.3: 18.35,5.99 X7.2
  Top 0.7: 22.41,15.27 19.82,12.67 | 19.82,12.67 19.82,9.66 19.82,7.46 18.35,5.99 | 19.82,12.67 22.86,15.72 23.12,15.72 R5.1
D_P  (1 unrouted)
  Top 0.3: 16.29,4.22 17.36,3.14 18.68,3.14 19,3.46 X7.3 | 19.05,4.23 19.05,5.18 21.27,7.41 R7.1
  Top 0.7: 16.29,4.22 16.29,6.44 17.14,7.3 18.26,7.3 18.82,7.86 18.82,13.1 22.67,16.96 23.09,16.96 R6.1
DMCU_N  (via drill 0.35)  (1 unrouted)
  Top 0.275: DD1.44 26.2,32.23 v25.72,31.75
  Top 0.3: 26.2,32.23
  Top 0.7: v30.48,23.81 30.48,19.47 27.04,16.03 25.93,16.03 25.46,15.56 R5.2
  Bottom 0.7: v25.72,31.75 25.69,31.69 25.69,27.33 29.21,23.81 30.16,23.81 v30.48,23.81
DMCU_P  (via drill 0.35)  (1 unrouted)
  Top 0.275: DD1.45 25.11,32.73 v24.77,32.39
  Top 0.3: 25.11,32.73
  Top 0.7: v29.53,22.86 29.53,19.95 26.57,16.99 25.14,16.99 R6.2
  Bottom 0.7: v24.77,32.38 24.63,32.07 24.63,26.96 28.73,22.86 v29.53,22.86
GND  (via drill 0.35)  (3 unrouted)
  Top 0.275: DD1.18 18.02,23.59 17.64,23.2 v17.6,23.2 | DD1.31 24.52,22.3 | C2.2 14.56,23.64 v14.9,23.3 | X3.8 16.15,18 v16.5,18
  Top 0.3: DD1.47 26.11,33.73 25.72,33.34 v23.5,33.34 | C5.2 28.31,36.14 27.67,36.14 | C10.2 4.23,31.75 | 4.23,31.75 v4.45,31.75 | C11.2 4.23,31.75 | C16.2 13.02,38 | 13.02,38 v13.02,37.47 | C4.2 18.62,38.69 18.62,38.08 18.02,37.48 DD1.63 | 24.52,22.3 C3.2 23.43,21.2 v23.1,21.2 | v17.14,28.89 16.98,28.73 DD1.12 11.61,28.73 11.53,28.8 C14.2 | 20,1.55 20.3,1.85 X7.5 20.3,5.38 22.23,7.3 v22.86,7.3 | X2.8 10.91,53.5 | 13.02,38 C17.2 | DD1.60 19.52,38.23 v19.65,38.1
  Top 0.5: C9.2 28.45,44.11 | C4.2 19.02,38.73 v19.65,38.1 | DD2.8 64.45,27.62 v63.82,26.99 | v52.7,6.67 51.12,5.08 v33.97,5.08 | v70.17,19.21 70.17,19.27 69.22,20.22 C15.2 68.68,20 DD2.2 64.45,20 v63.82,20.64 | C7.2 C6.2
  Top 0.7: 28.45,44.11 X1.P$6 28.45,48.94 34.96,55.45 | 25.08,27.94 v23.5,29.53 v23.5,30.8 v23.5,32.07 v23.5,33.34 | 10.91,53.5 v10.91,51.02 | 34.96,55.45 35.26,55.45 | C8.2 35.98,55.45 34.96,55.45
  Top 1: C12.- 27.53,5.67 DA4.1 26.79,8.44 C13.- | 27.67,36.14 27.09,35.56 v26.35,35.56 | 27.36,36.2 27.36,36.78 C1.2 28.36,43.61 C9.2 | C8.2 36.2,54.25 38.06,52.39 X5.3
  Bottom 0.3: v13.02,37.47 13.02,37.27
  Bottom 0.5: 17.46,26.67 17.46,24.13 16.69,23.36 16.69,23 | v4.45,31.75 19.05,31.75 | 25.08,25.08 23.81,26.35 | 19.05,33.66 19.37,33.97 19.37,37.82 v19.65,38.1 | v63.82,20.64 v63.82,26.99 | v70.17,19.21 67.15,19.21 65.41,17.46 63.82,17.46 53.02,6.67 v52.7,6.67 | v33.97,5.08 27.3,5.08 v25.72,6.67
  Bottom 0.7: v10.91,51.02 9.27,49.38 8.13,49.38 6.1,47.34 6.1,43.62 X8.1 6.08,42.22 8,40.3
  Bottom 1: 23.81,33.34 26.04,35.56 v26.35,35.56
  other vias: 30.48,25.4 27.3,22.86 23.5,28.26 22.86,8.57
  pour Bottom: 16.83,26.04 23.81,26.04 23.81,33.97 16.83,33.97
  pour Top: 23.18,32.7 23.18,28.26 27.78,23.65 30.16,26.04 28.26,26.04 26.35,26.04 26.04,26.35 26.04,30.8 24.45,30.8 24.45,31.43
  pour Bottom: 21.27,9.21 26.67,9.21 26.67,7.3 26.04,6.67 21.91,6.67 21.27,7.3
  pour Top: 27.62,22.23 26.67,23.18 26.67,24.77 27.94,26.04 30.48,26.04 30.96,25.56
  pour Top: 22.54,9.21 22.54,6.67 25.72,6.67 26.04,6.35 26.99,7.3 26.99,7.62 26.99,9.21
  pour Bottom: 26.31,23.06 28.26,21.11 28.26,20.64 27.94,20.32 26.35,18.73 21.91,18.73 17.14,13.97 17.14,10.48 15.88,9.21 15.56,9.21 14.92,8.57 13.02,8.57 13.02,3.97 15.56,3.97 16.03,4.45 16.03,7.14 16.19,7.3 16.51,7.3 18.1,7.3 18.41,6.99 19.68,6.99 20,6.99 21.91,6.99 21.91,12.38 22.86,13.34 25.72,13.34 32.07,19.68 32.07,20 32.07,26.04 31.75,26.35 30.8,26.35 29.92,25.48 30.32,25.08 30.62,24.79
  pour Top (no thermals): 13.02,8.57 13.02,0.64 24.45,0.64 24.45,6.67 22.54,6.67 22.54,8.89 13.02,8.89
  pour Bottom: 0.64,0.64 0.64,29.69 0.64,40.48 33.34,40.48 33.34,31.11 38.1,26.35 38.1,12.7 32.23,6.83 32.23,0.64
  pour Top (no thermals): 15.7,59.4 15.7,45.5 34.8,45.5 34.8,59.4
N$1
  Top 0.275: DD1.5 11.33,32.23 ZQ2.1
  Top 0.3: C10.1 6.18,34.51 ZQ2.1
N$2
  Top 0.275: DD1.6 10.84,31.73 7.62,28.51
  Top 0.3: 13.78,31.73 DD1.6 | C11.1 4.91,29 ZQ2.2 7.62,28.51
N$3
  Top 0.275: 47.31,24.86 DA3.1
  Top 0.3: C26.1 47.31,24.86
N$4
  Top 0.8: C18.1 62.33,42.97 DA1.1
N$5
  Top 0.275: 54.29,21.2 DA3.13
  Top 0.3: 54.29,21.2 55.63,22.54 DD2.13
N$6
  Top 0.275: DA3.14 52.81,21.7
  Top 0.3: 52.81,21.7 54.92,23.81 DD2.12
N$7
  Top 0.275: ZQ1.2 11.77,34.9 13.94,32.73 DD1.4
  Top 0.3: C17.1 10.58,37.7 ZQ1.2
N$8
  Top 0.275: 13.97,36.22 13.97,33.5 14.24,33.23 DD1.3
  Top 0.3: C16.1 14.27,37.55 ZQ1.1 13.97,36.22
N$9
  Top 0.3: 71.91,47.78 66.36,42.23 DA1.8
  Top 0.8: C18.2 65.94,41.27 DA1.8
  pour Top: 65.09,54.29 65.09,43.18 73.98,43.18 74.61,43.81 74.61,48.26 71.44,48.26 71.12,48.58 70.8,48.9 70.8,54.29
  pour Top (no thermals): 66.04,41.12 69.06,41.12 70.17,42.23 70.17,43.02 70.17,43.34 65.09,43.34 65.09,54.29 64.14,54.29 64.14,43.02
N$10
  Top 0.3: C22.1 55.46,40.9 R8.S 58.95,37.41 60.59,37.41 DA1.4
N$11
  Top 0.275: DA3.12 55.06,20.7
  Top 0.3: 55.06,20.7 55.63,21.27 DD2.14
N$12
  Top 0.3: R4.1 59.79,40.01 DA1.2
N$13
  Top 0.275: 22.52,40.31 DD1.54
  Top 0.3: X1.P$3 25.15,42.94 22.52,40.31
N$14  (via drill 0.35)
  Top 0.275: 23.02,39.85 DD1.53
  Top 0.3: 23.02,39.85 24.45,41.27 25.72,41.27 v26.99,40.01 | X1.P$5 27.3,47.26 v27.3,45.09
  Bottom 0.3: v27.3,45.09 27.3,40.32 v26.99,40.01
N$15  (via drill 0.35)
  Top 0.275: 23.52,39.41 DD1.52
  Top 0.3: 23.52,39.41 24.17,40.05 25.35,40.05 v25.4,40.01 | 24.13,47.23 X1.P$2 24.05,43.26 v24.13,43.18
  Bottom 0.3: v24.13,43.18 25.98,41.33 25.98,40.58 v25.4,40.01
N$16  (via drill 0.35)
  Top 0.275: DD1.51 24.02,38.63
  Top 0.3: 24.13,38.73 v24.45,39.05 24.02,38.63 | X1.P$1 22.95,42.32 v22.86,42.23
  Bottom 0.3: v24.45,39.05 24.45,40.32 22.86,41.91 v22.86,42.23
N$17  (via drill 0.35)
  Top 0.3: SW1.1 3.37,13 3.84,12.53 12.5,12.53 19.01,19.03 20.73,19.03 v21.1,19.4 | DD1.24 21.02,23.69 21.04,23.67 21.04,22.9 v21.24,22.7
  Bottom 0.3: v21.24,22.7 21.24,19.54 v21.1,19.4
N$18
  Top 0.275: 30.65,46.19 31.87,44.97 31.87,43.54 33.66,41.75 33.66,35.74 28.15,30.23 DD1.40
  Top 0.3: X1.P$8 30.65,46.19
N$19  (via drill 0.35)
  Top 0.275: DD1.39 28.46,29.73 34.42,35.7 34.42,42.09 32.72,43.8 v32.72,43.83 | X1.P$7 29.55,45.7 v30.48,44.77
  Bottom 0.275: v32.72,43.83 31.41,43.83 v30.48,44.77
N$22
  Top 0.7: R8.E 55.26,37.47 56.47,36.25 60.37,36.25 R2.2
N$23
  Top 0.275: 43.59,21.7 DA3.3
  Top 0.3: 43.59,21.7 42.86,20.98 R3.2 43.16,20
  Top 1.5: X4.P$1 42.86,7.98 R3.2
N$24
  Top 0.275: R11.1 6.76,19.25 8.94,19.25 11.65,16.54 14.78,16.54 15.21,16.96 X3.7 15.21,18.45 15.21,19.27 15.54,19.6 20.18,19.6 24,23.43 24,24.56 DD1.30
N$25
  Top 0.275: DA3.5 46.8,20.7
  Top 0.3: 46.8,20.7 46.55,20.45 46.55,19.94 45.44,18.84 R9.2 44.77,18.2 R10.1
N$26  (via drill 0.35)
  Top 0.275: DA3.11 51.87,20.2
  Top 0.3: 51.87,20.2 v52.39,19.68 | DD2.11 54.93,25.08 v53.02,23.18
  Bottom 0.3: v52.39,19.68 52.39,22.54 v53.02,23.18
N$27
  Top 0.275: R12.1 8.06,20.85 11.83,17.09 14.42,17.09 14.72,17.39 X3.6 14.72,19.72 15.08,20.08 19.98,20.08 23.52,23.62 DD1.29
N$28
  Top 0.275: X3.5 14.23,18.45 14.23,20 14.78,20.56 | DD1.23 20.5,24.56 20.5,22 19.06,20.56 14.78,20.56 | 14.78,20.56
N$29
  Top 0.275: DD1.22 20.01,22.19 18.86,21.04 14.58,21.04 13.72,20.17 13.72,18.45 X3.4
N$30
  Top 0.275: X3.3 13.2,20.4 14.31,21.51 18.6,21.51 19.52,22.43 DD1.21
N$31
  Top 0.275: X3.2 12.71,20.71 14.1,22.1 18.4,22.1 19.02,22.72 DD1.20
N$32
  Top 0.275: 31.91,46.52 35.24,43.18 35.24,35.72 32.91,33.38 28.75,29.23 DD1.38
  Top 0.3: X1.P$9 31.91,47.15 31.91,46.52
NRESET  (via drill 0.35)
  Top 0.275: 16.31,31.23 DD1.7 13.98,31.23 C14.1 | 16.93,31.85 16.93,32.6 17.87,33.55 21.12,33.55 v21.32,33.55
  Top 0.3: 16.31,31.23 16.93,31.85
  Bottom 0.275: 37.45,47.31 36.35,46.21 36.35,43.34 31.19,38.18
  Bottom 0.3: 37.45,47.31 X5.5 | 31.19,38.18 27.14,38.18 24.77,35.8 23.58,35.8 v21.32,33.55
OLED_CS  (via drill 0.35)
  Top 0.275: DD1.50 24.52,37.52
  Top 0.3: 24.52,37.52 24.94,37.93 24.94,37.95 v25.08,38.1 | X2.6 9.92,50.27 13.79,46.4 19.33,46.4 21.32,44.41 X8.7 21.32,43.37 22.17,42.52 v22.17,41.31
  Bottom 0.3: v25.08,38.1 24.39,38.1 22.17,40.31 v22.17,41.31
OLED_DC  (via drill 0.35)
  Top 0.275: DD1.58 20.52,38.84 20.26,39.1 | X2.2 7.91,48.19 v8.2,47.9
  Top 0.3: 20.26,39.1 v20,39.1
  Bottom 0.3: v20,39.1 20,40.7 18.78,41.92 X8.6 18.58,43.6 14.48,47.7 8.4,47.7 v8.2,47.9
OLED_MOSI
  Top 0.275: DD1.57 21.02,39.34 | X2.3 8.39,48.72 8.9,48.22
  Top 0.3: 21.02,39.34 20.57,39.8 17.5,39.8 X8.4 13.7,43.4 11.92,41.62 10.4,41.62 10.16,41.86 9.76,42.26 9.76,45.23 8.9,46.1 8.9,48.22
OLED_RS  (via drill 0.35)
  Top 0.275: 21.52,39.7 DD1.56
  Top 0.3: X2.4 8.9,49.3 10.1,48.1 v10.1,47 | 21.52,39.7 20.69,40.53 19.31,40.53 X8.5
  Bottom 0.3: X8.5 13.14,46.7 10.4,46.7 v10.1,47
OLED_SCK
  Top 0.275: DD1.55 22.02,39.95
  Top 0.3: 22.02,39.95 20.96,41.02 | 20.96,41.02 | 20.96,41.02 20.67,41.31 20.57,41.31 20.09,41.79 20.09,44.82 19.12,45.8 12.46,45.8 | 12.46,45.8 11.16,44.5 X8.3 11.1,43.66 11.1,48.1 9.41,49.79 X2.5 | 17.32,45.8 12.46,45.8
SWCLK  (via drill 0.35)
  Top 0.3: DD1.49 25.08,36.51 26.2,37.63 26.2,38.88 v26.04,39.05
  Bottom 0.275: 28.9,39.05 34.92,45.07 34.92,51.64 | 38.23,54.95 39.03,54.95 X5.2
  Bottom 0.3: v26.04,39.05 28.9,39.05 | 38.23,54.95 34.92,51.64
SWDIO  (via drill 0.35)
  Top 0.275: DD1.46 30.05,33.23 32.81,35.99 v32.81,41.65
  Bottom 0.275: 35.81,44.67 35.81,48.17 37.48,49.85 X5.4
  Bottom 0.3: 35.81,44.67 32.81,41.67 v32.81,41.65
VCC  (via drill 0.35)
  Top 0.3: X7.1 17.75,4.73 17.07,5.41 17.07,5.79 v17.3,6.03
  Top 1: DA4.3 32.16,5.04 C12.+ 31.56,2.99 v30.48,1.91
  Bottom 0.7: v17.3,6.03 17.46,6.03 17.7,5.8 23.52,5.8 23.92,5.4
  Bottom 1: 23.92,5.4 25.21,5.4 28.78,1.83 30.4,1.83 v30.48,1.91

### Text on the board
tPlace: 3.3V | CLK | X1 | GND | IO | RST | VoltaBox v5.1 | Yandex